# Altium project Aircraft.PrjPCB
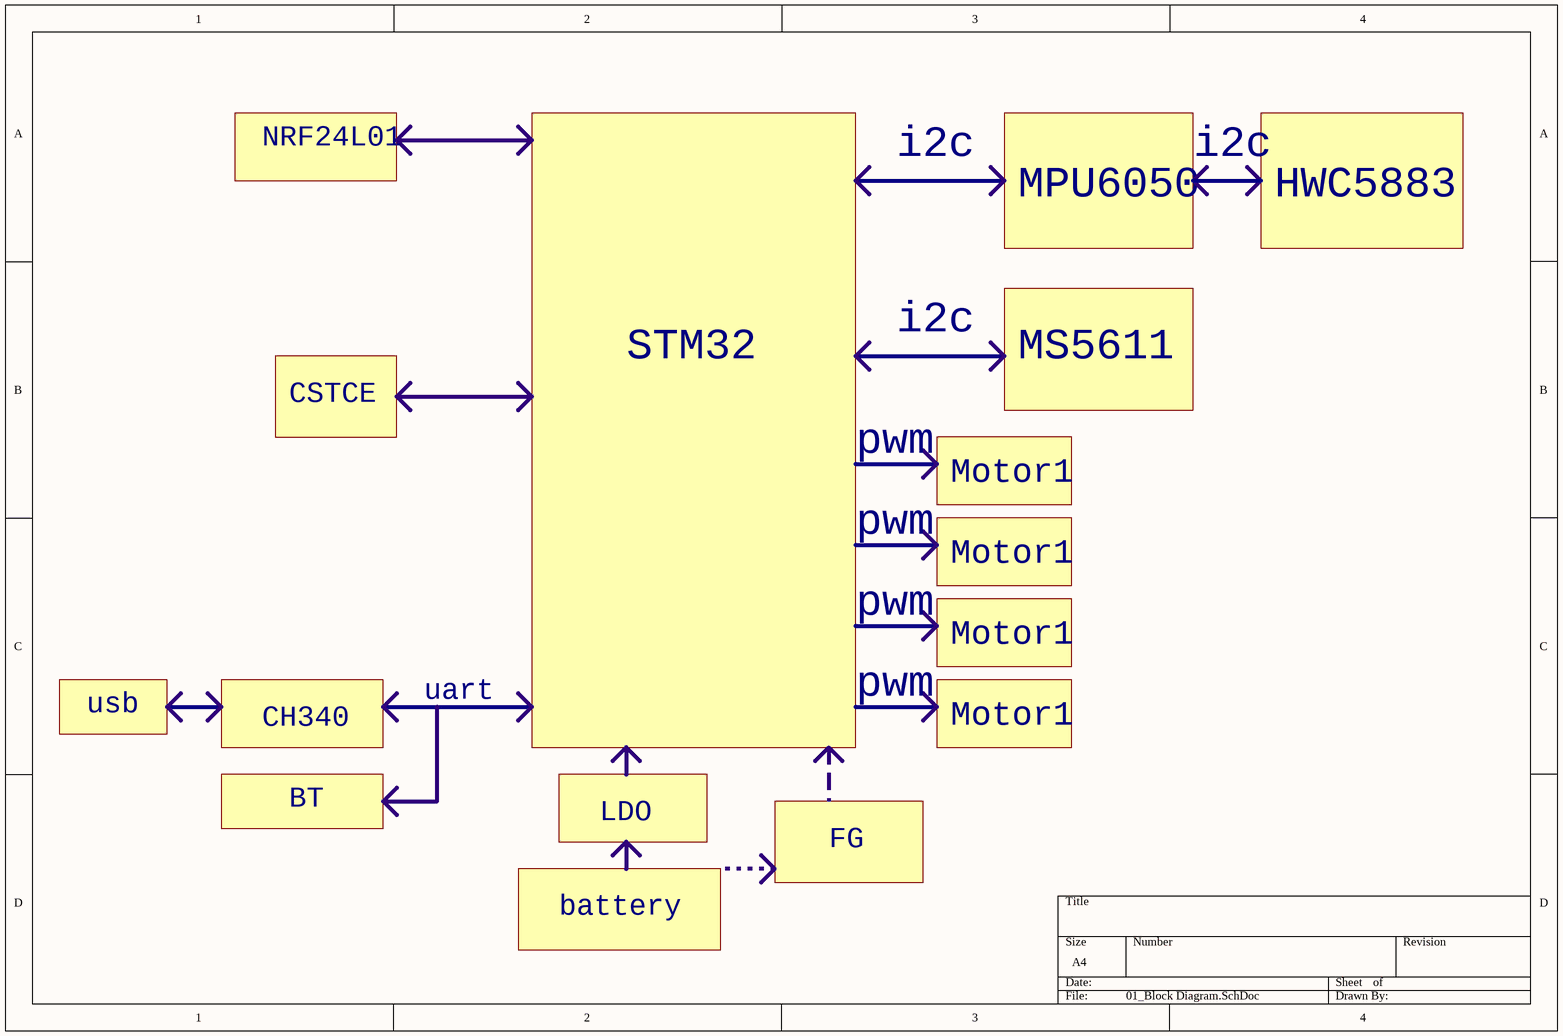
[diagram p0: 01_Block Diagram.SchDoc]
7 sheets, 97 parts. Net scope: global (net labels, ports and power ports of the same name join across sheets).
Board file: AIRCRAFT.PcbDoc
Sheets:
  01_Block Diagram.SchDoc
  02_MCU.SchDoc
  03_Power.SchDoc
  04_Sensor.SchDoc
  05_Motor.SchDoc
  06_LEDs.SchDoc
  07_Wireless.SchDoc

## Sheet 01_Block Diagram.SchDoc
size A4

### Notes on the sheet
- NRF24L01
- i2c
- MPU6050
- HWC5883
- STM32
- MS5611
- CSTCE
- pwm
- Motor1
- usb
- uart
- CH340
- BT
- LDO
- FG
- battery

## Sheet 02_MCU.SchDoc: 02_MCU
size A4; Organization: ASUS; Revision: V1; SheetNumber: 2; ProjectName: ATHENA
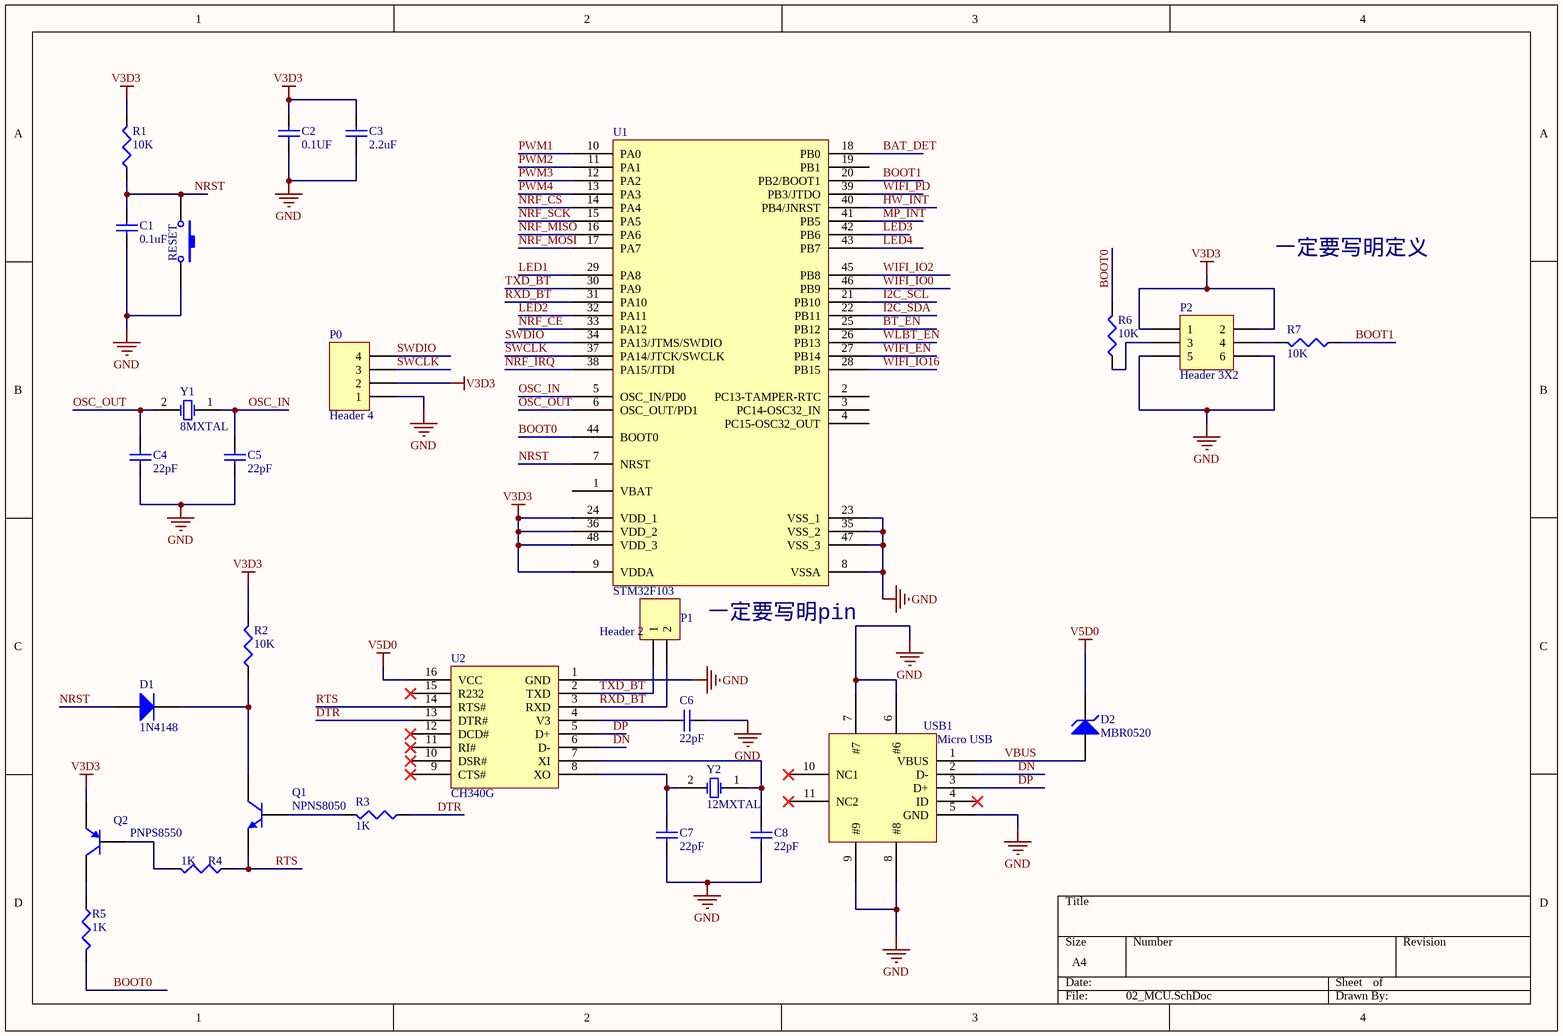
[diagram p1: 02_MCU.SchDoc]

### Parts
C1  value 0.1uF  [0402]  (hidden comment: Cap)
C2  value 0.1UF  [0402]  (hidden comment: Cap)
C3  value 2.2uF  [0402]  (hidden comment: Cap)
C4  value 22pF  [0402]  (hidden comment: Cap)
C5  value 22pF  [0402]  (hidden comment: Cap)
C6  value 22pF  [0402]  (hidden comment: Cap)
C7  value 22pF  [0402]  (hidden comment: Cap)
C8  value 22pF  [0402]  (hidden comment: Cap)
D1  1N4148  [0603]
D2  MBR0520  [6-0805_N]
P0  Header 4  [HDR1X4]
P1  Header 2  [HDR1X2]
P2  Header 3X2  [HDR2X3]
Q1  NPNS8050  [SOT-23_M]
Q2  PNPS8550  [SOT-23_M]
R1  value 10K  [0402]  (hidden comment: Res3)
R2  value 10K  [0402]  (hidden comment: Res3)
R3  value 1K  [0402]  (hidden comment: Res3)
R4  value 1K  [0402]  (hidden comment: Res3)
R5  value 1K  [0402]  (hidden comment: Res3)
R6  value 10K  [0402]  (hidden comment: Res3)
R7  value 10K  [0402]  (hidden comment: Res3)
RESET  SW-PB  [SWFOOT]  (value not drawn)
U1  STM32F103  [LQFP48S]
U2  CH340G  [SSOP16_M]
USB1  Micro USB  [Micro_USB]
Y1  8MXTAL  [XTAL2]
Y2  12MXTAL  [XTAL2]

### Nets
GND: C1.2 C2.2 C3.2 C4.2 C5.1 C6.1 C7.2 C8.1 P0.1 P2.5 P2.6 RESET.2 U1.8(VSSA) U1.23(VSS_1) U1.35(VSS_2) U1.47(VSS_3) U2.1(GND) USB1.5(GND) USB1.6(#6) USB1.7(#7) USB1.8(#8) USB1.9(#9)
V3D3: C2.1 C3.1 P0.2 P2.1 P2.2 Q2.3(E) R1.2 R2.2 U1.9(VDDA) U1.24(VDD_1) U1.36(VDD_2) U1.48(VDD_3)
V5D0: D2.2(K) U2.16(VCC)
VBUS: D2.1(A) USB1.1(VBUS)
BAT_DET: U1.18(PB0)
BOOT0: R5.2 R6.2 U1.44(BOOT0)
BOOT1: R7.1 U1.20(PB2/BOOT1)
BT_EN: U1.25(PB12)
DN: U2.6(D-) USB1.2(D-)
DP: U2.5(D+) USB1.3(D+)
DTR: R3.1 U2.13(DTR#)
HW_INT: U1.40(PB4/JNRST)
I2C_SCL: U1.21(PB10)
I2C_SDA: U1.22(PB11)
LED1: U1.29(PA8)
LED2: U1.32(PA11)
LED3: U1.42(PB6)
LED4: U1.43(PB7)
MP_INT: U1.41(PB5)
NRF_CE: U1.33(PA12)
NRF_CS: U1.14(PA4)
NRF_IRQ: U1.38(PA15/JTDI)
NRF_MISO: U1.16(PA6)
NRF_MOSI: U1.17(PA7)
NRF_SCK: U1.15(PA5)
NRST: C1.1 D1.1(A) R1.1 RESET.1 U1.7(NRST)
OSC_IN: C5.2 U1.5(OSC_IN/PD0) Y1.1(OSC1)
OSC_OUT: C4.1 U1.6(OSC_OUT/PD1) Y1.2(OSC2)
PWM1: U1.10(PA0)
PWM2: U1.11(PA1)
PWM3: U1.12(PA2)
PWM4: U1.13(PA3)
RTS: Q1.3(E) R4.1 U2.14(RTS#)
RXD_BT: P1.2 U1.31(PA10) U2.3(RXD)
SWCLK: P0.3 U1.37(PA14/JTCK/SWCLK)
SWDIO: P0.4 U1.34(PA13/JTMS/SWDIO)
TXD_BT: P1.1 U1.30(PA9) U2.2(TXD)
WIFI_EN: U1.27(PB14)
WIFI_IO0: U1.46(PB9)
WIFI_IO2: U1.45(PB8)
WIFI_IO16: U1.28(PB15)
WIFI_PD: U1.39(PB3/JTDO)
WLBT_EN: U1.26(PB13)
NetC6_2: C6.2 U2.4(V3)
NetC7_1: C7.1 U2.8(XO) Y2.2(OSC2)
NetC8_2: C8.2 U2.7(XI) Y2.1(OSC1)
NetD1_2: D1.2(K) Q1.1(C) R2.1
NetP2_3: P2.3 R6.1
NetP2_4: P2.4 R7.2
NetQ1_2: Q1.2(B) R3.2
NetQ2_1: Q2.1(C) R5.1
NetQ2_2: Q2.2(B) R4.2

Not connected (* = marked no-connect by the designer): U1 1(VBAT) 2(PC13-TAMPER-RTC) 3(PC14-OSC32_IN) 4(PC15-OSC32_OUT) 19(PB1); U2 9(CTS#)* 10(DSR#)* 11(RI#)* 12(DCD#)* 15(R232)*; USB1 4(ID)* 10(NC1)* 11(NC2)*

### Notes on the sheet
- 一定要写明定义
- 一定要写明pin

### Library data of the parts
C1-C8 = Cap: Capacitor; Published: 8-Jun-2000; LatestRevisionDate: 17-Jul-2002; LatestRevisionNote: Re-released for DXP Platform.; PackageReference: RAD-0.3; Publisher: Altium Limited; PackageDescription: Radial Cap, Thru-Hole; 2 Leads; 0.3 in Pin Spacing
D1 = Diode 1N4148: High Conductance Fast Diode; Published: 8-Jun-2000; LatestRevisionDate: 17-Jul-2002; LatestRevisionNote: Re-released for DXP Platform.; DatasheetVersion: 1997; PackageReference: DO-35; Publisher: Altium Limited; PackageDescription: Diode, Axial; Body 3.8 x 1.9 mm (LxDia. max), Lead Dia. 0.53 mm (max); Code_JEDEC: DO-204-AH; ComponentLink1Description: Manufacturer Link; ComponentLink1URL: http://www.fairchildsemi.com/; ComponentLink2Description: Datasheet; ComponentLink2URL: http://www.fairchildsemi.com/ds/1N%2F1N4148.pdf
D2 = D Zener: Zener Diode; Published: 8-Jun-2000; LatestRevisionDate: 17-Jul-2002; LatestRevisionNote: Re-released for DXP Platform.; PackageReference: DIODE-0.7; Publisher: Altium Limited; PackageDescription: Diode, Thru-Hole; 2 Leads; 0.7 in Pin Spacing
P0 = Header 4: Header, 4-Pin; LatestRevisionDate: 17-Jul-2002; LatestRevisionNote: Re-released for DXP Platform.; Publisher: Altium Limited
P1 = Header 2: Header, 2-Pin; LatestRevisionDate: 17-Jul-2002; LatestRevisionNote: Re-released for DXP Platform.; Publisher: Altium Limited
P2 = Header 3X2: Header, 3-Pin, Dual row; LatestRevisionDate: 17-Jul-2002; LatestRevisionNote: Re-released for DXP Platform.; Publisher: Altium Limited
Q1 = NPN: NPN Bipolar Transistor; Published: 8-Jun-2000; LatestRevisionDate: 17-Jul-2002; LatestRevisionNote: Re-released for DXP Platform.; PackageReference: TO-226-AA; Publisher: Altium Limited; PackageDescription: TO, Flat Index; 3 In-Line, Axial Leads; Body Dia. 4.8mm; Leads 0.55 x 0.51 mm (max); Code_JEDEC: TO-226-AA
Q2 = PNP: PNP Bipolar Transistor; Published: 8-Jun-2000; LatestRevisionDate: 29-May-2009; LatestRevisionNote: IPC-7351 Footprint Added.; PackageVersion: Aug-1999; PackageReference: SOT-23B; Publisher: Altium Limited; PackageDescription: 3-Pin SOT-23 Package 0.95 mm Pitch, 2.4 mm Lead Span
R1-R7 = Res3: Resistor; Published: 8-Jun-2000; LatestRevisionDate: 29-May-2009; LatestRevisionNote: IPC-7351 Footprint Added.; PackageReference: J1-0603; Publisher: Altium Limited; PackageDescription: Chip Resistor
RESET = SW-PB: Switch; Published: 24-Mar-1999; LatestRevisionDate: 17-Jul-2002; LatestRevisionNote: Re-released for DXP Platform.; PackageReference: SPST-2; Publisher: Altium Limited; PackageDescription: Switch; 2 Leads
Y1 Y2 = XTAL: Crystal Oscillator; Published: 8-Jun-2000; LatestRevisionDate: 17-Jul-2002; LatestRevisionNote: Re-released for DXP Platform.; PackageReference: R38; Publisher: Altium Limited; PackageDescription: Crystal, Thru-Hole; 2 Leads; Body 3.1 x 8.2 mm (Dia.xH)

## Sheet 03_Power.SchDoc
size A4
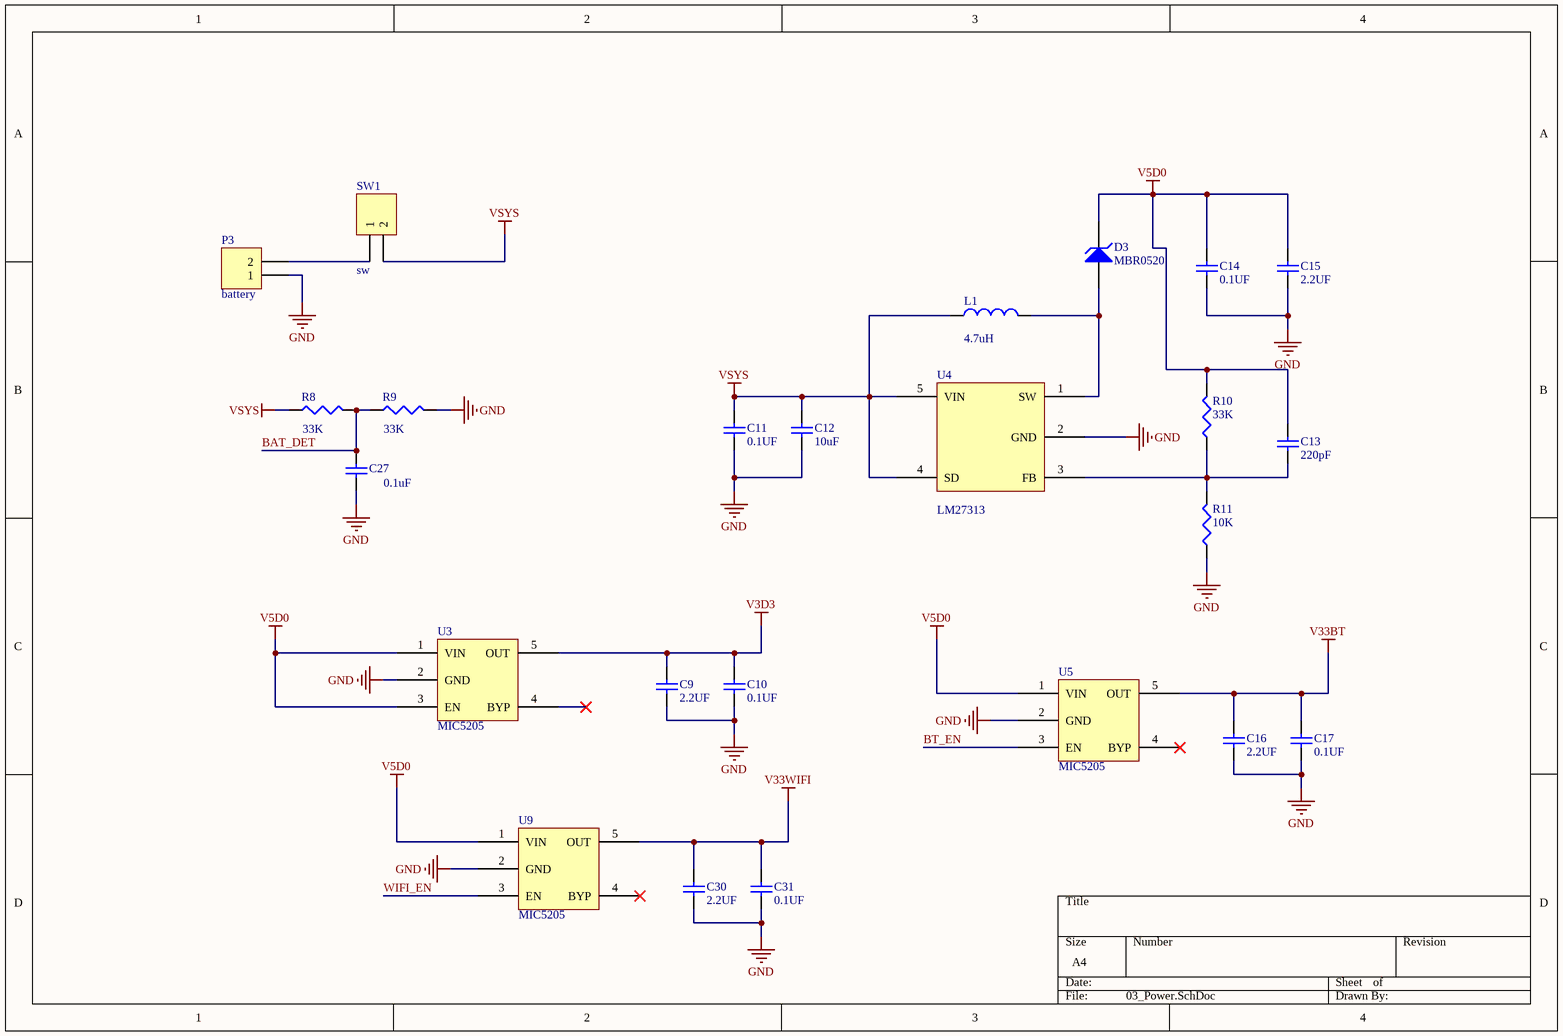
[diagram p2: 03_Power.SchDoc]

### Parts
C9  value 2.2UF  [0402]  (hidden comment: Cap)
C10  value 0.1UF  [0402]  (hidden comment: Cap)
C11  value 0.1UF  [0402]  (hidden comment: Cap)
C12  value 10uF  [0402]  (hidden comment: Cap)
C13  value 220pF  [0402]  (hidden comment: Cap)
C14  value 0.1UF  [0402]  (hidden comment: Cap)
C15  value 2.2UF  [0402]  (hidden comment: Cap)
C16  value 2.2UF  [0402]  (hidden comment: Cap)
C17  value 0.1UF  [0402]  (hidden comment: Cap)
C27  value 0.1uF  [0402]  (hidden comment: Cap)
C30  value 2.2UF  [0402]  (hidden comment: Cap)
C31  value 0.1UF  [0402]  (hidden comment: Cap)
D3  MBR0520  [6-0805_N]
L1  value 4.7uH  [0402-A]  (hidden comment: Inductor)
P3  battery  [HDR1X2]
R8  value 33K  [0402]  (hidden comment: Res3)
R9  value 33K  [0402]  (hidden comment: Res3)
R10  value 33K  [0402]  (hidden comment: Res3)
R11  value 10K  [0402]  (hidden comment: Res3)
SW1  sw  [HDR1X2]
U3  MIC5205  [SOT25-5]
U4  LM27313  [SOT25-5]
U5  MIC5205  [SOT25-5]
U9  MIC5205  [SOT25-5]

### Nets
GND: C9.2 C10.2 C11.2 C12.2 C14.2 C15.2 C16.2 C17.2 C27.1 C30.2 C31.2 P3.1 R9.2 R11.1 U3.2(GND) U4.2(GND) U5.2(GND) U9.2(GND)
V3D3: C9.1 C10.1 U3.5(OUT)
V5D0: C13.1 C14.1 C15.1 D3.2(K) R10.2 U3.1(VIN) U3.3(EN) U5.1(VIN) U9.1(VIN)
V33BT: C16.1 C17.1 U5.5(OUT)
V33WIFI: C30.1 C31.1 U9.5(OUT)
VSYS: C11.1 C12.1 L1.1 R8.1 SW1.2 U4.4(SD) U4.5(VIN)
BAT_DET: C27.2 R8.2 R9.1
BT_EN: U5.3(EN)
WIFI_EN: U9.3(EN)
NetC13_2: C13.2 R10.1 R11.2 U4.3(FB)
NetD3_1: D3.1(A) L1.2 U4.1(SW)
NetP3_2: P3.2 SW1.1

Not connected (* = marked no-connect by the designer): U3 4(BYP)*; U5 4(BYP)*; U9 4(BYP)*

### Library data of the parts
C9-C17 C27 C30 C31 = Cap: Capacitor; Published: 8-Jun-2000; LatestRevisionDate: 17-Jul-2002; LatestRevisionNote: Re-released for DXP Platform.; PackageReference: RAD-0.3; Publisher: Altium Limited; PackageDescription: Radial Cap, Thru-Hole; 2 Leads; 0.3 in Pin Spacing
D3 = D Zener: Zener Diode; Published: 8-Jun-2000; LatestRevisionDate: 17-Jul-2002; LatestRevisionNote: Re-released for DXP Platform.; PackageReference: DIODE-0.7; Publisher: Altium Limited; PackageDescription: Diode, Thru-Hole; 2 Leads; 0.7 in Pin Spacing
L1 = Inductor: Code_IEC: 1005; Published: 8-Jun-2000; LatestRevisionDate: 29-May-2009; LatestRevisionNote: IPC-7351 Footprint Added.; PackageReference: 0402-A; Publisher: Altium Limited; PackageDescription: Chip Inductor; Code_JEITA: 0402
P3 SW1 = Header 2: Header, 2-Pin; LatestRevisionDate: 17-Jul-2002; LatestRevisionNote: Re-released for DXP Platform.; Publisher: Altium Limited
R8-R11 = Res3: Resistor; Published: 8-Jun-2000; LatestRevisionDate: 29-May-2009; LatestRevisionNote: IPC-7351 Footprint Added.; PackageReference: J1-0603; Publisher: Altium Limited; PackageDescription: Chip Resistor

## Sheet 04_Sensor.SchDoc
size A4
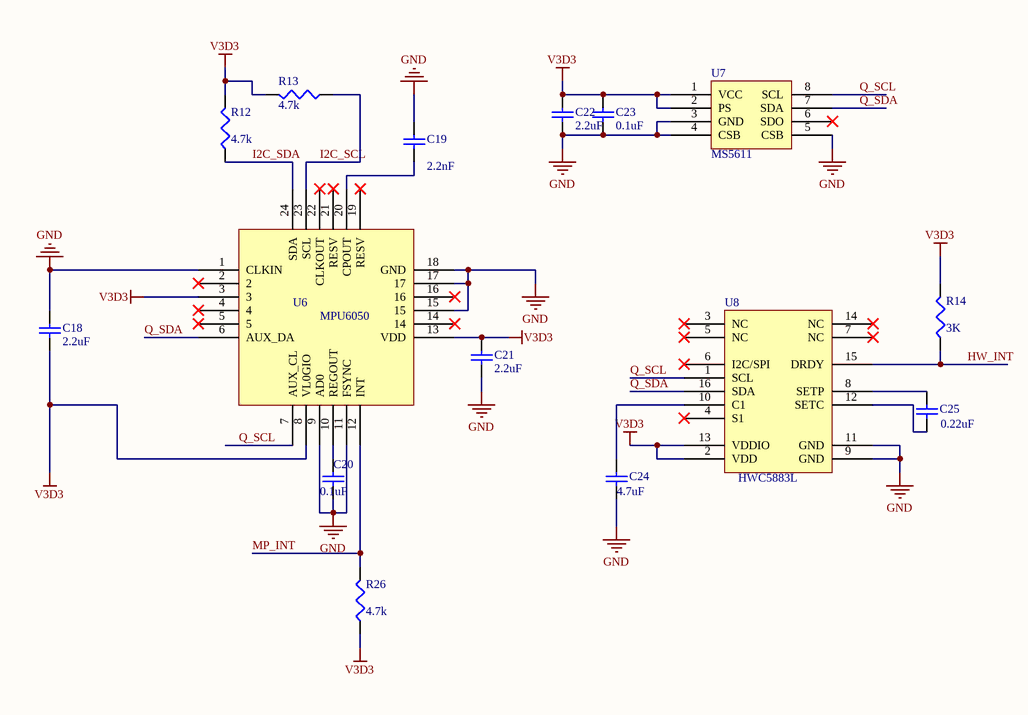
[diagram p3: 04_Sensor.SchDoc]

### Parts
C18  value 2.2uF  [0402]  (hidden comment: Cap)
C19  value 2.2nF  [0402]  (hidden comment: Cap)
C20  value 0.1uF  [0402]  (hidden comment: Cap)
C21  value 2.2uF  [0402]  (hidden comment: Cap)
C22  value 2.2uF  [0402]  (hidden comment: Cap)
C23  value 0.1uF  [0402]  (hidden comment: Cap)
C24  value 4.7uF  [0402]  (hidden comment: Cap)
C25  value 0.22uF  [0402]  (hidden comment: Cap)
R12  value 4.7k  [0402]  (hidden comment: Res3)
R13  value 4.7k  [0402]  (hidden comment: Res3)
R14  value 3K  [0402]  (hidden comment: Res3)
R26  value 4.7k  [0402]  (hidden comment: Res3)
U6  MPU6050  [QFN24]
U7  MS5611  [MS5611 - duplicate]
U8  HWC5883L  [HMC5883L]

### Nets
GND: C18.2 C19.2 C20.1 C21.1 C22.1 C23.1 C24.1 U6.1(CLKIN) U6.9(AD0) U6.11(FSYNC) U6.15 U6.17 U6.18(GND) U7.3(GND) U7.4(CSB) U7.5(CSB) U8.9(GND) U8.11(GND)
V3D3: C18.1 C21.2 C22.2 C23.2 R12.2 R13.2 R14.2 R26.1 U6.3 U6.8(VL0GIO) U6.13(VDD) U7.1(VCC) U7.2(PS) U8.2(VDD) U8.13(VDDIO)
HW_INT: R14.1 U8.15(DRDY)
I2C_SCL: R13.1 U6.23(SCL)
I2C_SDA: R12.1 U6.24(SDA)
MP_INT: R26.2 U6.12(INT)
Q_SCL: U6.7(AUX_CL) U7.8(SCL) U8.1(SCL)
Q_SDA: U6.6(AUX_DA) U7.7(SDA) U8.16(SDA)
NetC19_1: C19.1 U6.20(CPOUT)
NetC20_2: C20.2 U6.10(REGOUT)
NetC24_2: C24.2 U8.10(C1)
NetC25_1: C25.1 U8.12(SETC)
NetC25_2: C25.2 U8.8(SETP)

Not connected (* = marked no-connect by the designer): U6 2* 4* 5* 14* 16* 19(RESV)* 21(RESV)* 22(CLKOUT)*; U7 6(SDO)*; U8 3(NC)* 4(S1)* 5(NC)* 6(I2C/SPI)* 7(NC)* 14(NC)*

### Library data of the parts
C18-C25 = Cap: Capacitor; Published: 8-Jun-2000; LatestRevisionDate: 17-Jul-2002; LatestRevisionNote: Re-released for DXP Platform.; PackageReference: RAD-0.3; Publisher: Altium Limited; PackageDescription: Radial Cap, Thru-Hole; 2 Leads; 0.3 in Pin Spacing
R12-R14 R26 = Res3: Resistor; Published: 8-Jun-2000; LatestRevisionDate: 29-May-2009; LatestRevisionNote: IPC-7351 Footprint Added.; PackageReference: J1-0603; Publisher: Altium Limited; PackageDescription: Chip Resistor
U8 = HMC5883L

## Sheet 05_Motor.SchDoc
size A4
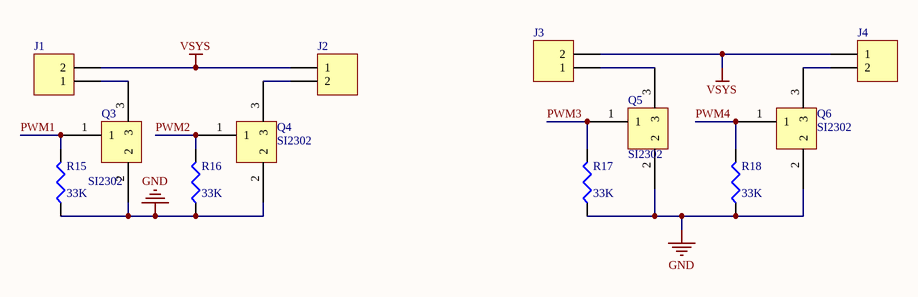
[diagram p4: 05_Motor.SchDoc]

### Parts
J1  Header 2  [HDR1X2]  (value not drawn)
J2  Header 2  [HDR1X2]  (value not drawn)
J3  Header 2  [HDR1X2]  (value not drawn)
J4  Header 2  [HDR1X2]  (value not drawn)
Q3  SI2302  [SOT-23_M]
Q4  SI2302  [SOT-23_M]
Q5  SI2302  [SOT-23_M]
Q6  SI2302  [SOT-23_M]
R15  value 33K  [0402]  (hidden comment: Res3)
R16  value 33K  [0402]  (hidden comment: Res3)
R17  value 33K  [0402]  (hidden comment: Res3)
R18  value 33K  [0402]  (hidden comment: Res3)

### Nets
GND: Q3.2 Q4.2 Q5.2 Q6.2 R15.1 R16.1 R17.1 R18.1
VSYS: J1.2 J2.1 J3.2 J4.1
PWM1: Q3.1 R15.2
PWM2: Q4.1 R16.2
PWM3: Q5.1 R17.2
PWM4: Q6.1 R18.2
NetJ1_1: J1.1 Q3.3
NetJ2_2: J2.2 Q4.3
NetJ3_1: J3.1 Q5.3
NetJ4_2: J4.2 Q6.3

### Library data of the parts
J1-J4 = Header 2: Header, 2-Pin; LatestRevisionDate: 17-Jul-2002; LatestRevisionNote: Re-released for DXP Platform.; Publisher: Altium Limited
R15-R18 = Res3: Resistor; Published: 8-Jun-2000; LatestRevisionDate: 29-May-2009; LatestRevisionNote: IPC-7351 Footprint Added.; PackageReference: J1-0603; Publisher: Altium Limited; PackageDescription: Chip Resistor

## Sheet 06_LEDs.SchDoc
size A4
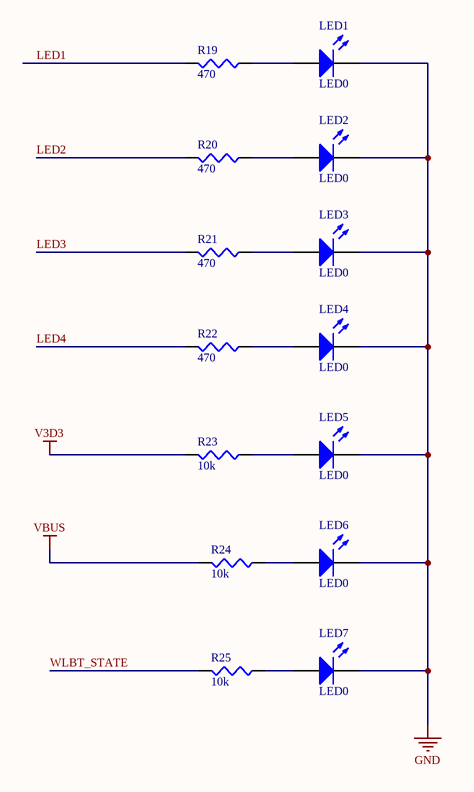
[diagram p5: 06_LEDs.SchDoc]

### Parts
LED1  LED0  [J1-0603]
LED2  LED0  [J1-0603]
LED3  LED0  [J1-0603]
LED4  LED0  [J1-0603]
LED5  LED0  [J1-0603]
LED6  LED0  [J1-0603]
LED7  LED0  [J1-0603]
R19  value 470  [0402]  (hidden comment: Res3)
R20  value 470  [0402]  (hidden comment: Res3)
R21  value 470  [0402]  (hidden comment: Res3)
R22  value 470  [0402]  (hidden comment: Res3)
R23  value 10k  [0402]  (hidden comment: Res3)
R24  value 10k  [0402]  (hidden comment: Res3)
R25  value 10k  [0402]  (hidden comment: Res3)

### Nets
GND: LED1.2(K) LED2.2(K) LED3.2(K) LED4.2(K) LED5.2(K) LED6.2(K) LED7.2(K)
V3D3: R23.2
VBUS: R24.2
LED1: R19.2
LED2: R20.2
LED3: R21.2
LED4: R22.2
WLBT_STATE: R25.2
NetLED1_1: LED1.1(A) R19.1
NetLED2_1: LED2.1(A) R20.1
NetLED3_1: LED3.1(A) R21.1
NetLED4_1: LED4.1(A) R22.1
NetLED5_1: LED5.1(A) R23.1
NetLED6_1: LED6.1(A) R24.1
NetLED7_1: LED7.1(A) R25.1

### Library data of the parts
LED1-LED7 = LED0: Typical INFRARED GaAs LED; Published: 8-Jun-2000; LatestRevisionDate: 08-Jul-2005; LatestRevisionNote: Mech Layer 1 removed.; PackageReference: LED-0; Publisher: Altium Limited; PackageDescription: LED; 2 Leads
R19-R25 = Res3: Resistor; Published: 8-Jun-2000; LatestRevisionDate: 29-May-2009; LatestRevisionNote: IPC-7351 Footprint Added.; PackageReference: J1-0603; Publisher: Altium Limited; PackageDescription: Chip Resistor

## Sheet 07_Wireless.SchDoc
size A4
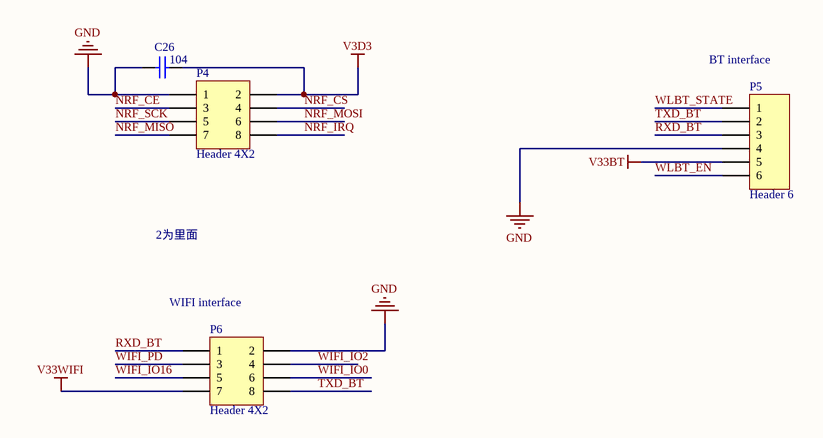
[diagram p6: 07_Wireless.SchDoc]

### Parts
C26  value 104  [0402]  (hidden comment: Cap)
P4  Header 4X2  [HDR2X4]
P5  Header 6  [HDR1X6]
P6  Header 4X2  [HDR2X4]

### Nets
GND: C26.1 P4.1 P5.4 P6.2
V3D3: C26.2 P4.2
V33BT: P5.5
V33WIFI: P6.7
NRF_CE: P4.3
NRF_CS: P4.4
NRF_IRQ: P4.8
NRF_MISO: P4.7
NRF_MOSI: P4.6
NRF_SCK: P4.5
RXD_BT: P5.3 P6.1
TXD_BT: P5.2 P6.8
WIFI_IO0: P6.6
WIFI_IO2: P6.4
WIFI_IO16: P6.5
WIFI_PD: P6.3
WLBT_EN: P5.6
WLBT_STATE: P5.1

### Notes on the sheet
- (near P5) BT interface
- 2为里面
- (near P6) WIFI interface

### Library data of the parts
C26 = Cap: Capacitor; Published: 8-Jun-2000; LatestRevisionDate: 17-Jul-2002; LatestRevisionNote: Re-released for DXP Platform.; PackageReference: RAD-0.3; Publisher: Altium Limited; PackageDescription: Radial Cap, Thru-Hole; 2 Leads; 0.3 in Pin Spacing
P4 P6 = Header 4X2: Header, 4-Pin, Dual row; LatestRevisionDate: 17-Jul-2002; LatestRevisionNote: Re-released for DXP Platform.; Publisher: Altium Limited
P5 = Header 6: Header, 6-Pin; LatestRevisionDate: 17-Jul-2002; LatestRevisionNote: Re-released for DXP Platform.; Publisher: Altium Limited

## Nets that join several sheets
GND: 02_MCU (22 pins), 03_Power (18 pins), 04_Sensor (18 pins), 05_Motor (8 pins), 06_LEDs (7 pins), 07_Wireless (C26.1 P4.1 P5.4 P6.2)
V3D3: 02_MCU (12 pins), 03_Power (C9.1 C10.1 U3.5), 04_Sensor (15 pins), 06_LEDs (R23.2), 07_Wireless (C26.2 P4.2)
V5D0: 02_MCU (D2.2 U2.16), 03_Power (9 pins)
V33BT: 03_Power (C16.1 C17.1 U5.5), 07_Wireless (P5.5)
V33WIFI: 03_Power (C30.1 C31.1 U9.5), 07_Wireless (P6.7)
VBUS: 02_MCU (D2.1 USB1.1), 06_LEDs (R24.2)
VSYS: 03_Power (7 pins), 05_Motor (J1.2 J2.1 J3.2 J4.1)
BAT_DET: 02_MCU (U1.18), 03_Power (C27.2 R8.2 R9.1)
BT_EN: 02_MCU (U1.25), 03_Power (U5.3)
HW_INT: 02_MCU (U1.40), 04_Sensor (R14.1 U8.15)
I2C_SCL: 02_MCU (U1.21), 04_Sensor (R13.1 U6.23)
I2C_SDA: 02_MCU (U1.22), 04_Sensor (R12.1 U6.24)
LED1: 02_MCU (U1.29), 06_LEDs (R19.2)
LED2: 02_MCU (U1.32), 06_LEDs (R20.2)
LED3: 02_MCU (U1.42), 06_LEDs (R21.2)
LED4: 02_MCU (U1.43), 06_LEDs (R22.2)
MP_INT: 02_MCU (U1.41), 04_Sensor (R26.2 U6.12)
NRF_CE: 02_MCU (U1.33), 07_Wireless (P4.3)
NRF_CS: 02_MCU (U1.14), 07_Wireless (P4.4)
NRF_IRQ: 02_MCU (U1.38), 07_Wireless (P4.8)
NRF_MISO: 02_MCU (U1.16), 07_Wireless (P4.7)
NRF_MOSI: 02_MCU (U1.17), 07_Wireless (P4.6)
NRF_SCK: 02_MCU (U1.15), 07_Wireless (P4.5)
PWM1: 02_MCU (U1.10), 05_Motor (Q3.1 R15.2)
PWM2: 02_MCU (U1.11), 05_Motor (Q4.1 R16.2)
PWM3: 02_MCU (U1.12), 05_Motor (Q5.1 R17.2)
PWM4: 02_MCU (U1.13), 05_Motor (Q6.1 R18.2)
RXD_BT: 02_MCU (P1.2 U1.31 U2.3), 07_Wireless (P5.3 P6.1)
TXD_BT: 02_MCU (P1.1 U1.30 U2.2), 07_Wireless (P5.2 P6.8)
WIFI_EN: 02_MCU (U1.27), 03_Power (U9.3)
WIFI_IO0: 02_MCU (U1.46), 07_Wireless (P6.6)
WIFI_IO2: 02_MCU (U1.45), 07_Wireless (P6.4)
WIFI_IO16: 02_MCU (U1.28), 07_Wireless (P6.5)
WIFI_PD: 02_MCU (U1.39), 07_Wireless (P6.3)
WLBT_EN: 02_MCU (U1.26), 07_Wireless (P5.6)
WLBT_STATE: 06_LEDs (R25.2), 07_Wireless (P5.1)